# Altium schematic sheet power-v2.1.SchDoc
size A4
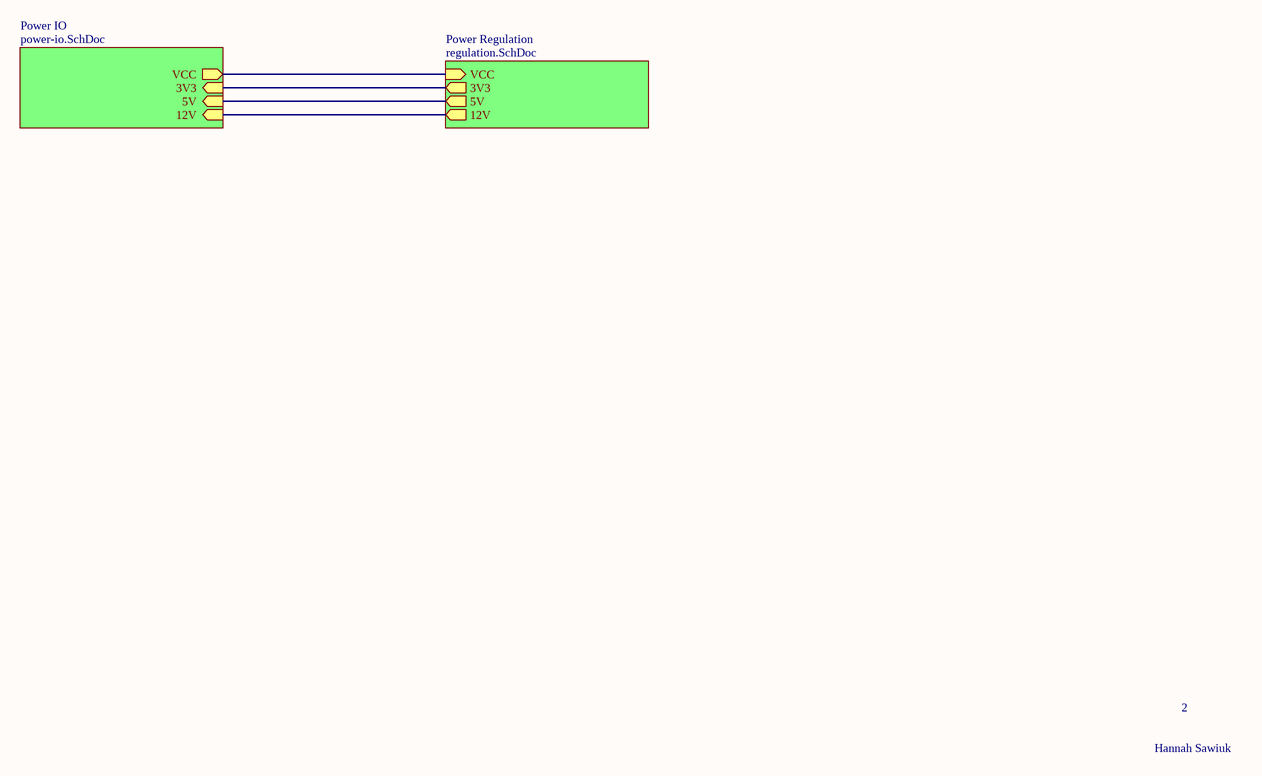
[diagram p0: power-v2.1.SchDoc]

## Sub-sheets
Power IO = power-io.SchDoc: VCC (out), 3V3 (in), 5V (in), 12V (in)
Power Regulation = regulation.SchDoc: 3V3 (out), 5V (out), 12V (out), VCC (in)

## Nets
(unnamed): sheet Power IO/VCC, sheet Power Regulation/VCC
(unnamed): sheet Power IO/3V3, sheet Power Regulation/3V3
(unnamed): sheet Power IO/5V, sheet Power Regulation/5V
(unnamed): sheet Power IO/12V, sheet Power Regulation/12V

## Notes on the sheet
- 2
- Hannah Sawiuk